# EAGLE design icm-20948-breakout (EAGLE 9.2.2)
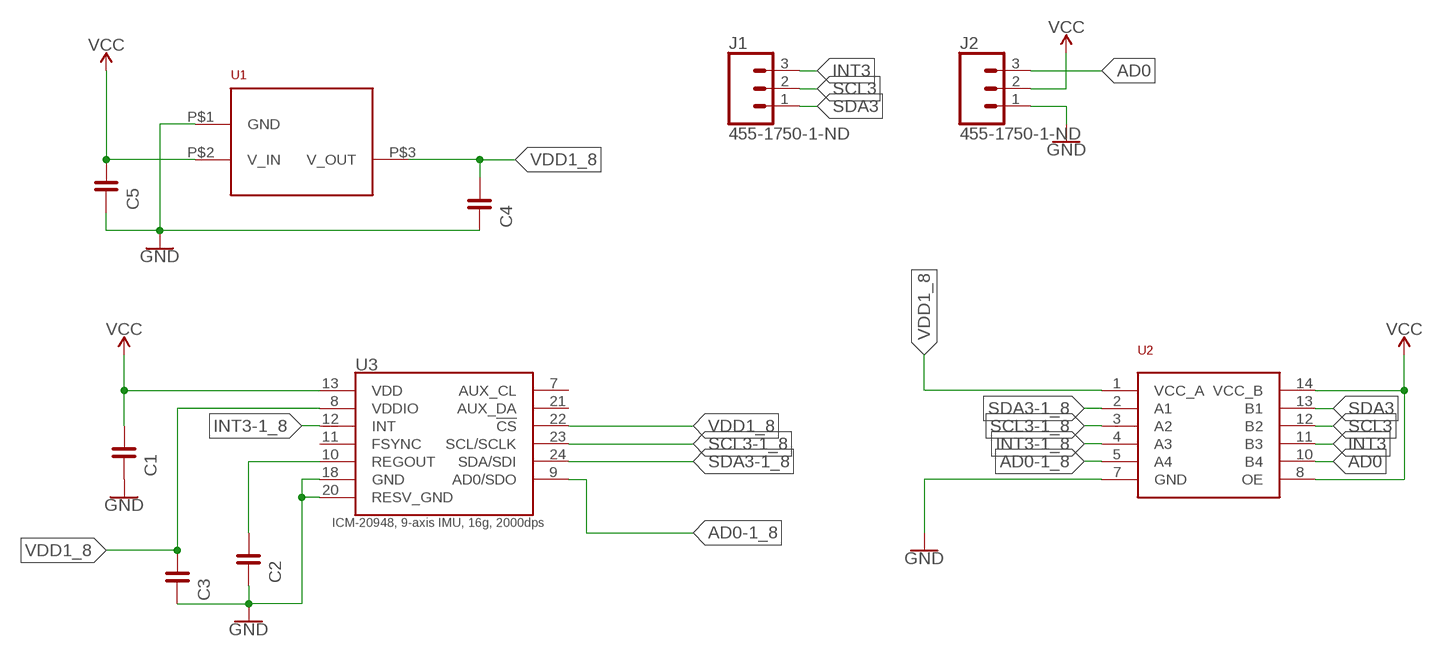
[diagram p0: schematic, sheet 1]

## Parts
C1  0.1uF  CAPACITOR-0402  [0402]
C2  0.1uF  CAPACITOR-0402  [0402]
C3  0.1uF  CAPACITOR-0402  [0402]
C4  1.0uF  CAPACITOR-0402  [0402]
C5  1.0uF  CAPACITOR-0402  [0402]
J1  455-1750-1-ND  CONN_03  [1X03]
J2  455-1750-1-ND  CONN_03  [1X03]
U1  NCP563  [SC−82AB]
U2  NTS0104  NTS0104DHVQFN14  [SOT762-1]
U3  ICM-20948  ICM-20948QFN24-COARSE  [SPARKFUN-SENSORS_MPU-9250]

## Nets
AD0: J2.3 U2.10(B4)
AD0-1_8: U2.5(A4) U3.9(AD0/SDO)
GND: C1.P$2 C2.P$2 C3.P$2 C4.P$2 C5.P$2 J2.1 U1.P$1(GND) U2.7(GND) U3.18(GND) U3.20(RESV_GND)
INT3: J1.3 U2.11(B3)
INT3-1_8: U2.4(A3) U3.12(INT)
N$1: C2.P$1 U3.10(REGOUT)
SCL3: J1.2 U2.12(B2)
SCL3-1_8: U2.3(A2) U3.23(SCL/SCLK)
SDA3: J1.1 U2.13(B1)
SDA3-1_8: U2.2(A1) U3.24(SDA/SDI)
VCC: C1.P$1 C5.P$1 J2.2 U1.P$2(V_IN) U2.8(OE) U2.14(VCC_B) U3.13(VDD)
VDD1_8: C3.P$1 C4.P$1 U1.P$3(V_OUT) U2.1(VCC_A) U3.8(VDDIO) U3.22(!CS)
Unconnected: U3.7(AUX_CL) U3.11(FSYNC) U3.21(AUX_DA)

## Library data of the parts
C1-C5 = FaBo-Capacitor:CAPACITOR: CAPACITOR
J1 J2 = SparkFun-Connectors:CONN_03: Multi connection point. Often used as Generic Header-pin footprint for 0.1 inch spaced/style header connections On any of the 0.1 inch spaced packages, you can populate with these: Break Away Headers - Straight <https://www.sparkfun.com/products/116> (PRT-00116) Break Away Male Headers - Right Angle <https://www.sparkfun.com/products/553> (PRT-00553) Female Headers <https://www.sparkfun.com/products/115> (PRT-00115) Break Away Headers - Machine Pin <https://www.sparkfun.com/products/117> (PRT-00117) Break Away Female Headers - Swiss Machine Pin <https://www.sparkfun.com/products/743> (PRT-00743) Stackable Header - 3 Pin (Female, 0.1") <https://www.sparkfun.com/products/13875> (PRT-13875) For SCREWTERMINALS and SPRING TERMINALS visit here: Screw Terimnals on SparkFun.com <https://www.sparkfun.com/search/results?term=Screw+Terminals> (5mm/3.5mm/2.54mm spacing) This device is also useful as a general connection point to wire up your design to another part of your project. Our various solder wires solder well into these plated through hole pads. Hook-Up Wire - Assortment (Stranded, 22 AWG) <https://www.sparkfun.com/products/11375> (PRT-11375) Hook-Up Wire - Assortment (Solid Core, 22 AWG) <https://www.sparkfun.com/products/11367> (PRT-11367) View the entire wire category on our website here <https://www.sparkfun.com/categories/141> Special notes: Molex polarized connector foot print use with SKU : PRT-08232 with associated crimp pins and housings.; PROD_ID: XXX-00000
U1 = david-mems:NCP563
U2 = david-mems:NTS0104
U3 = david-mems:ICM-20948

## Board
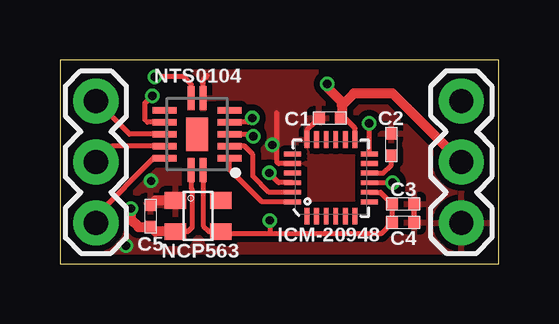
[diagram p1: board, top side]
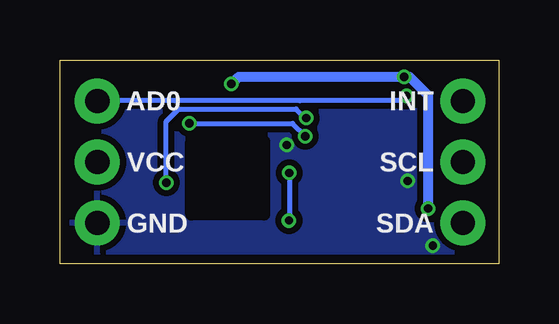
[diagram p2: board, bottom side, seen from below]

Size 18.3 x 8.5 mm. Coordinates in mm from the lower left corner, seen from the top.
Outline: 0,0 18.3,0 18.3,8.5 0,8.5 0,0
Copper layers (1*16): Top 0.035559375mm / dielectric 1.6mm / Bottom 0.035559375mm
Design rules "oshpark-2layer *": minimum track width 6mil, minimum drill 10mil, track to track 6mil, track to pad 6mil, pad to pad 6mil, via to via 6mil, smd to smd 6mil, copper to edge 15mil, drill to drill 6mil, minimum pad ring 5mil, minimum via ring 5mil, stop-mask expansion 2.5mil, vias tented up to drill 14mil, thermal gap 10mil

### Footprints (pad centres in the part's own frame; a part is rotated, then mirrored left to right if it is on the bottom)
0402 = smd 0.5 x 0.5: P$1 -0.46,0; P$2 0.46,0
1X03 = drill 1.016 pad 1.88: 1 0,0; 2 2.54,0; 3 5.08,0
SC−82AB = smd 0.7 x 0.9: P$1 -0.65,-0.95; P$2 0.65,-0.95; P$3 0.65,0.95; P$4 -0.65,0.95
SOT762-1 = smd 1 x 0.29: 1 -1.5,-0.25; 7 1.5,-0.25; 8 1.5,0.25; 14 -1.5,0.25 | smd 0.29 x 1: 2 -1,-1.35; 3 -0.5,-1.35; 4 0,-1.35; 5 0.5,-1.35; 6 1,-1.35; 9 1,1.35; 10 0.5,1.35; 11 0,1.35; 12 -0.5,1.35; 13 -1,1.35 | smd 1.4 x 0.9: CP 0,0
SPARKFUN-SENSORS_MPU-9250 = smd 0.7 x 0.2: 1 -1.6,1; 2 -1.6,0.6; 3 -1.6,0.2; 4 -1.6,-0.2; 5 -1.6,-0.6; 6 -1.6,-1; 13 1.6,-1; 14 1.6,-0.6; 15 1.6,-0.2; 16 1.6,0.2; 17 1.6,0.6; 18 1.6,1 | smd 0.2 x 0.7: 7 -1,-1.6; 8 -0.6,-1.6; 9 -0.2,-1.6; 10 0.2,-1.6; 11 0.6,-1.6; 12 1,-1.6; 19 1,1.6; 20 0.6,1.6; 21 0.2,1.6; 22 -0.2,1.6; 23 -0.6,1.6; 24 -1,1.6

### Placement (x,y rotation side)
C1  11.25,6.07 180 top
C2  13.81,4.97 90 top
C3  14.31,2.49 0 top
C4  14.31,1.71 0 top
C5  3.78,1.99 90 top
J1  1.5,1.7 90 top
J2  16.74,1.7 90 top
U1  5.77,1.99 270 top
U2  5.72,5.4 90 top
U3  11.3,3.58 90 top

### Tracks (layer width: path | path; a pad name or v marks a point on that pad's centre or on a via)
AD0  (via drill 0.35)
  Top 0.203: U2.10 3.65,5.9 3.55,6 3.55,6.7 v3.85,7
  Bottom 0.203: v3.85,7 4.05,6.8 8.3,6.8 8.3,6.81 13.5,6.81 13.5,6.8 16.72,6.8 J2.3
AD0-1_8  (via drill 0.35)
  Top 0.203: U3.9 13.77,3.38 13.8,3.35 13.83,3.38 v13.87,3.38 | v8.02,6.08 7.84,5.9 U2.5
  Bottom 0.203: v13.87,3.38 13.87,5.93 13.35,6.45 8.45,6.45 8.05,6.05 v8.03,6.08 v8.02,6.08
GND  (via drill 0.35)
  Top 0.152: 4.69,2.63 U1.P$1
  Top 0.203: C4.P$2 C3.P$2 | C1.P$2 10.5,5.78 10.3,5.58 U3.18 | U3.20 9.12,4.18 9.05,4.25 9.05,6.3 | U2.7 5.97,7.67 6.15,7.85
  Top 0.406: U1.P$1 3.97,2.64 C5.P$2
  other vias: 3.8,3.45 8.85,4.95 2.75,0.75
  pour Bottom (isolate 0.254): 0,8.5 18.3,8.5 18.3,0 0,0
  pour Top (isolate 0.254): 0,8.5 0,0 18.3,0 18.3,8.5
INT3
  Top 0.203: U2.11 2.9,5.4 1.52,6.78 J1.3
INT3-1_8  (via drill 0.35)
  Top 0.203: U2.4 7.95,5.4 8.03,5.32 v8.07,5.32 | U3.12 12.9,5.7 v12.9,5.85
  Bottom 0.203: v12.9,5.85 8.6,5.85 v8.07,5.32
N$1
  Top 0.203: U3.10 13.48,3.78 13.81,4.11 C2.P$1
SCL3
  Top 0.203: U2.12 2.16,4.9 J1.2
SCL3-1_8
  Top 0.203: U3.23 8.72,2.98 8.05,3.65 8.05,4.55 7.7,4.9 U2.3
SDA3
  Top 0.203: U2.13 3.9,4.4 1.5,2 J1.1
SDA3-1_8
  Top 0.203: U3.24 8.42,2.58 7.07,3.93 U2.2
VCC  (via drill 0.35)
  Top 0.2: U2.8 5.47,7.28
  Top 0.203: U2.14 5.47,3.14 5.52,3.09 5.52,1.52 5.34,1.34 U1.P$2 | U3.13 12.3,5.65 11.88,6.07 11.75,6.07 C1.P$1 | U2.8 5.47,7.48 5.15,7.8 v3.95,7.8
  Top 0.406: 11.75,6.6 11.75,6.07 | U1.P$2 3.97,1.34 C5.P$1 3.27,1.53 2.95,1.85 v2.95,2.3 | 11.75,6.6 12.25,7.1 13.88,7.1 J2.2 | 11.75,6.6 11.75,6.75 11.15,7.35 v11.15,7.5
  Bottom 0.406: v11.15,7.5 10.85,7.8 v3.95,7.8 3.72,7.8 2.95,7.03 v2.95,2.3
VDD1_8  (via drill 0.35)
  Top 0.2: 5.97,3.88 U2.1
  Top 0.203: U3.8 13.37,2.98 C3.P$1 C4.P$1 13.39,1.25 8.8,1.25 | U2.1 5.97,1.58 6.21,1.34 U1.P$3 6.8,1.25 8.8,1.25 | U3.22 9.12,3.38 8.73,3.77 v8.73,3.78 | v8.75,1.8 8.75,1.3 8.8,1.25
  Bottom 0.203: v8.73,3.78 8.73,1.87 8.75,1.85 v8.75,1.8

### Text on the board
tPlace: NCP563
bPlace: INT | AD0 | SCL | VCC | SDA | GND